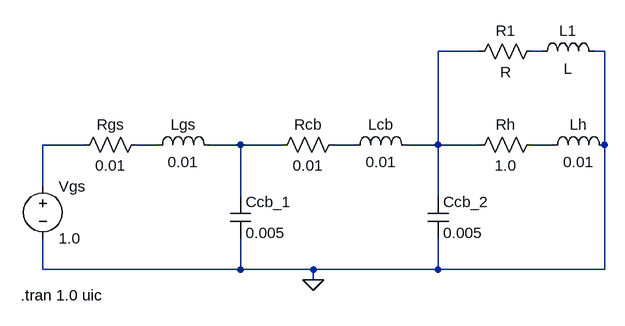
[diagram p0: schematic notional_ship1.asc]
notional_ship1.asc, the LTspice schematic file:
Version 4
SHEET 1 936 680
WIRE 736 -128 672 -128
WIRE 832 -128 816 -128
WIRE 928 -128 912 -128
WIRE 128 16 64 16
WIRE 240 16 208 16
WIRE 368 16 320 16
WIRE 432 16 368 16
WIRE 544 16 512 16
WIRE 672 16 672 -128
WIRE 672 16 624 16
WIRE 736 16 672 16
WIRE 848 16 816 16
WIRE 928 16 928 -128
WIRE 64 80 64 16
WIRE 368 96 368 16
WIRE 672 96 672 16
WIRE 64 208 64 160
WIRE 368 208 368 160
WIRE 368 208 64 208
WIRE 480 208 368 208
WIRE 672 208 672 160
WIRE 672 208 480 208
WIRE 928 208 928 16
WIRE 928 208 672 208
WIRE 480 224 480 208
FLAG 480 224 0
SYMBOL voltage 64 64 R0
WINDOW 123 0 0 Left 0
WINDOW 39 0 0 Left 0
SYMATTR InstName Vgs
SYMATTR Value 1.0
SYMBOL res 224 0 R90
WINDOW 0 0 56 VBottom 2
WINDOW 3 32 56 VTop 2
SYMATTR InstName Rgs
SYMATTR Value 0.01
SYMBOL res 528 0 R90
WINDOW 0 0 56 VBottom 2
WINDOW 3 32 56 VTop 2
SYMATTR InstName Rcb
SYMATTR Value 0.01
SYMBOL res 832 0 R90
WINDOW 0 0 56 VBottom 2
WINDOW 3 32 56 VTop 2
SYMATTR InstName Rh
SYMATTR Value 1.0
SYMBOL ind 224 32 R270
WINDOW 0 32 56 VTop 2
WINDOW 3 5 56 VBottom 2
SYMATTR InstName Lgs
SYMATTR Value 0.01
SYMBOL ind 528 32 R270
WINDOW 0 32 56 VTop 2
WINDOW 3 5 56 VBottom 2
SYMATTR InstName Lcb
SYMATTR Value 0.01
SYMBOL ind 832 32 R270
WINDOW 0 32 56 VTop 2
WINDOW 3 5 56 VBottom 2
SYMATTR InstName Lh
SYMATTR Value 0.01
SYMBOL cap 352 96 R0
SYMATTR InstName Ccb_1
SYMATTR Value 0.005
SYMBOL cap 656 96 R0
SYMATTR InstName Ccb_2
SYMATTR Value 0.005
SYMBOL res 720 -112 R270
WINDOW 0 32 56 VTop 2
WINDOW 3 0 56 VBottom 2
SYMATTR InstName R1
SYMBOL ind 816 -112 R270
WINDOW 0 32 56 VTop 2
WINDOW 3 5 56 VBottom 2
SYMATTR InstName L1
TEXT 30 248 Left 2 !.tran 1.0 uic

The netlist it stands for:
* notional_ship1.asc
Vgs N003 0 1.0
Rgs N004 N003 0.01
Rcb N006 N005 0.01
Rh N007 N001 1.0
Lgs N004 N005 0.01
Lcb N006 N001 0.01
Lh N007 0 0.01
Ccb_1 N005 0 0.005
Ccb_2 N001 0 0.005
R1 N001 N002 R
L1 N002 0 L
.tran 1.0 uic
.backanno
.end